# Altium schematic sheet TK106_MIDI.SchDoc
size A3; Revision: 6
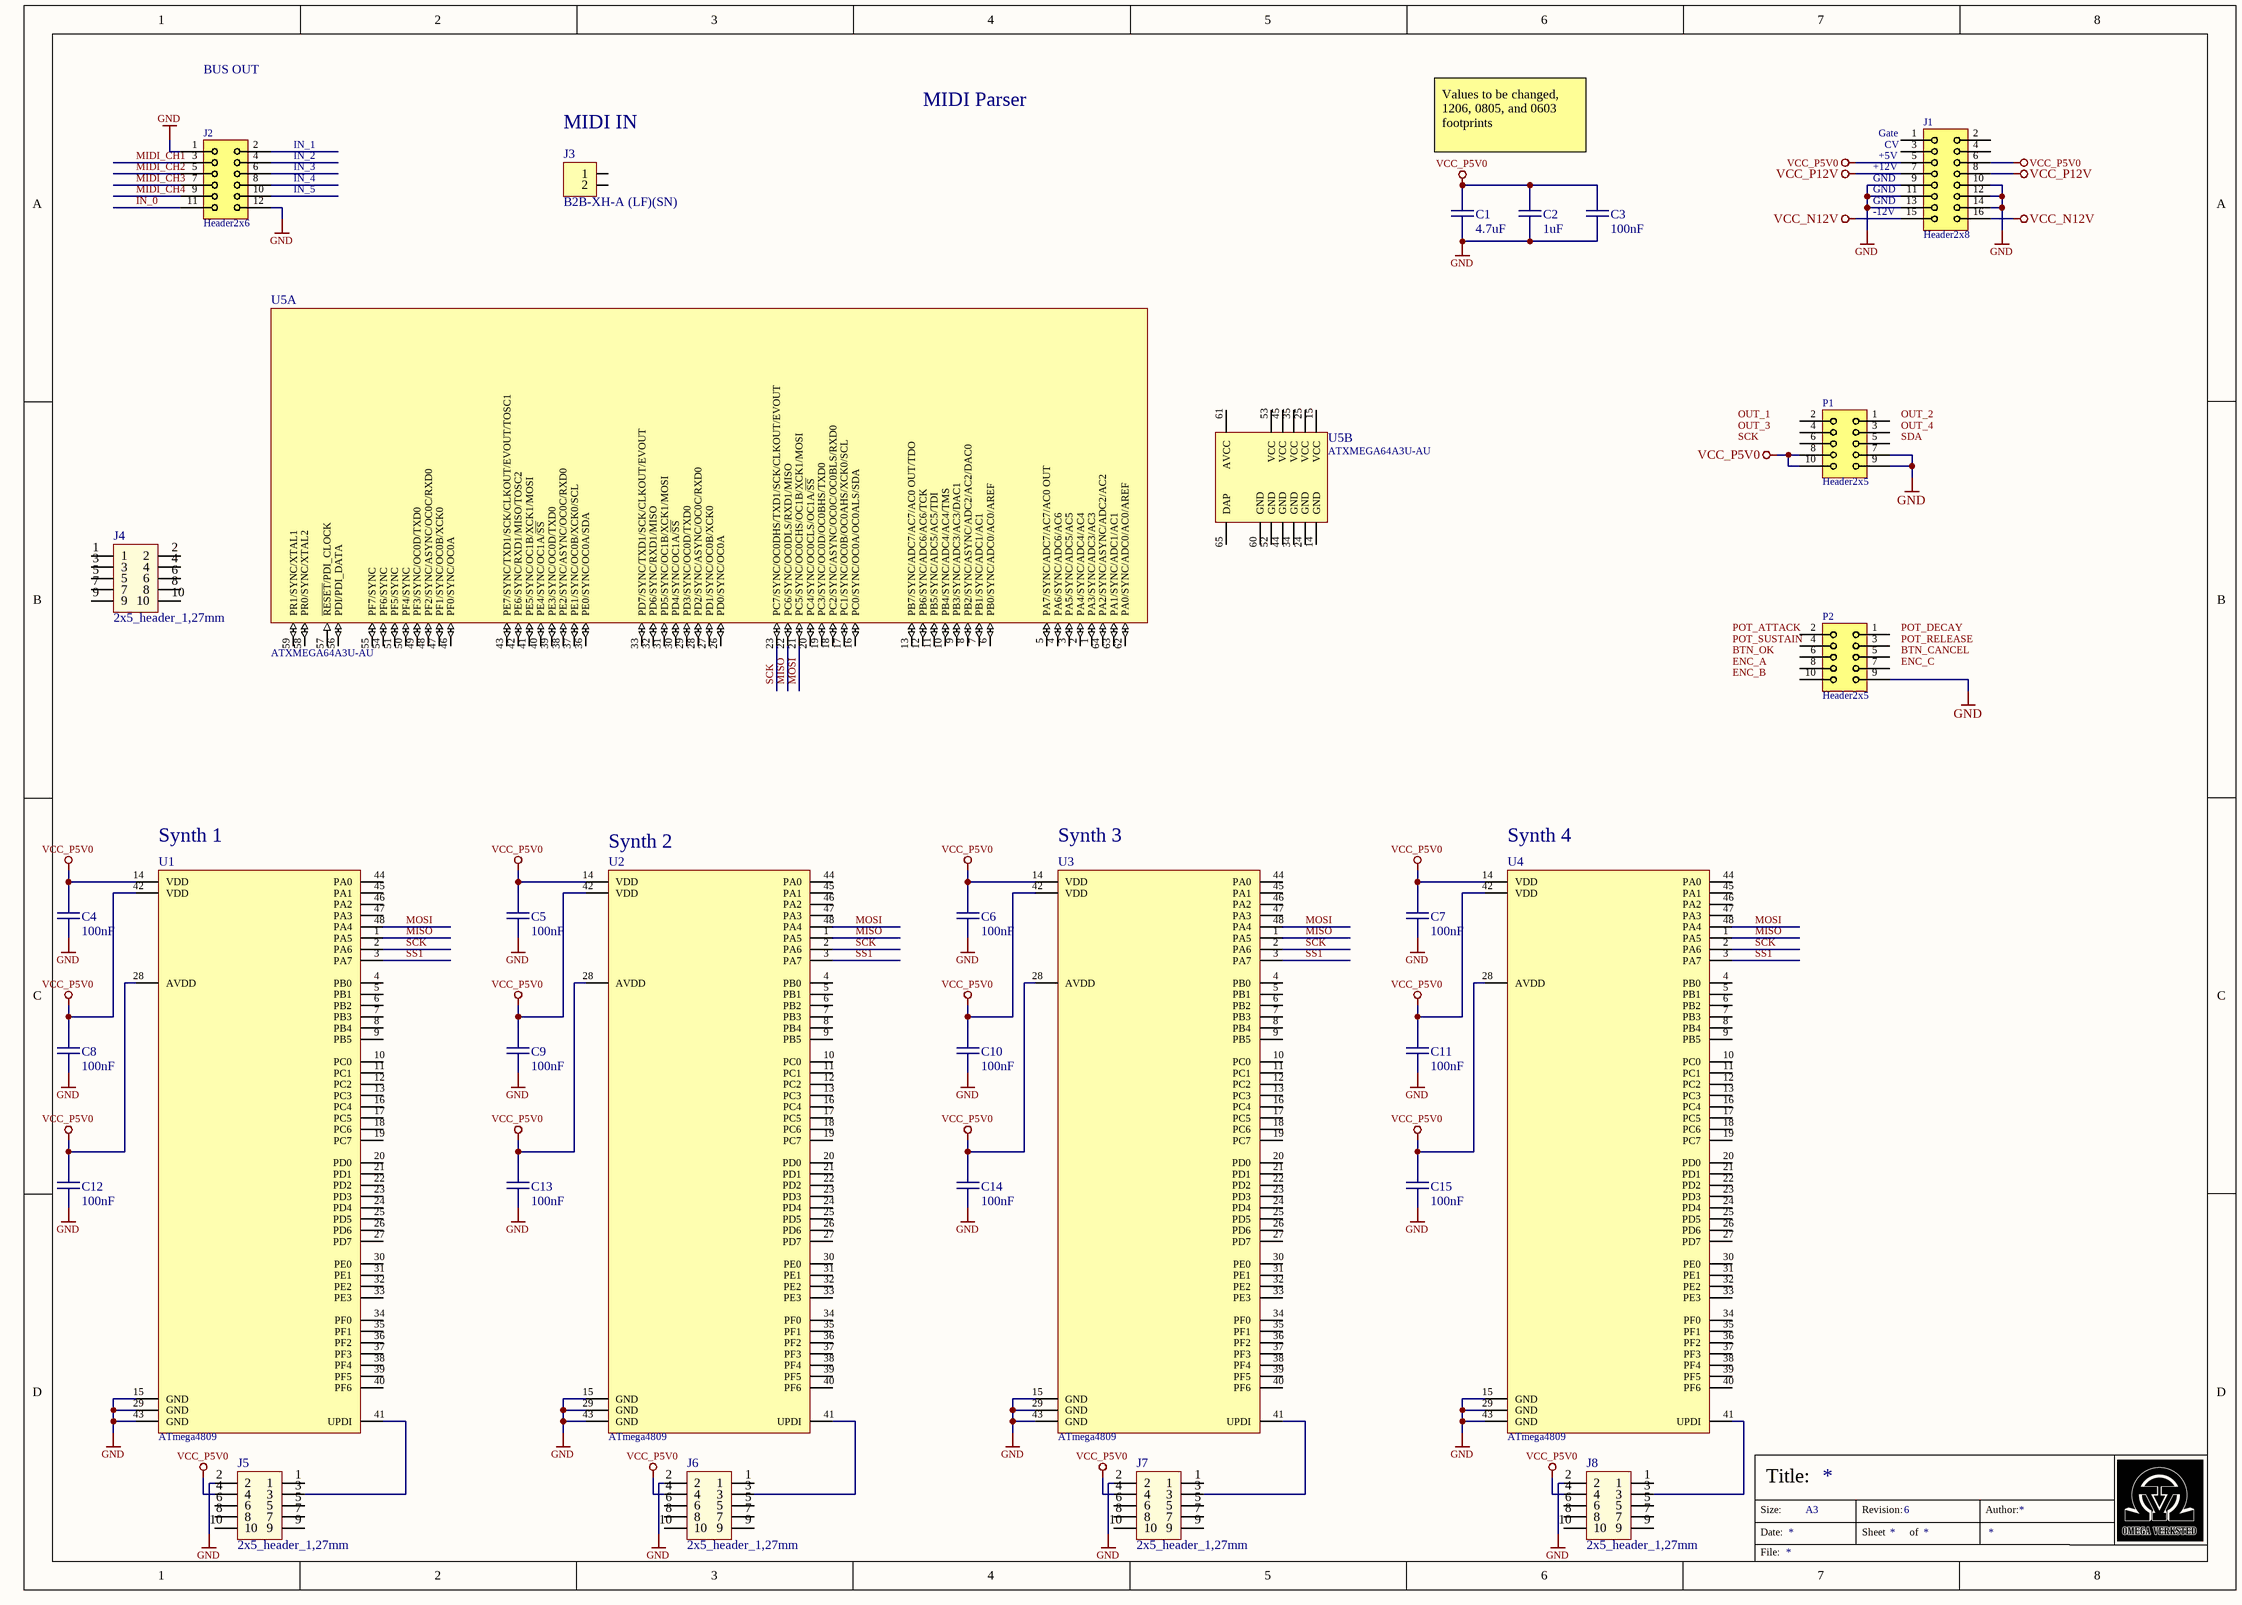
[diagram p0: TK106_MIDI.SchDoc]

## Parts
C1  4.7uF  [CAPC1206(3216)170_N]
C2  1uF  [CAPC0805(2012)100_N]
C3  100nF  [CAPC0603(1608)55_N]
C4  100nF  [CAPC0603(1608)55_N]
C5  100nF  [CAPC0603(1608)55_N]
C6  100nF  [CAPC0603(1608)55_N]
C7  100nF  [CAPC0603(1608)55_N]
C8  100nF  [CAPC0603(1608)55_N]
C9  100nF  [CAPC0603(1608)55_N]
C10  100nF  [CAPC0603(1608)55_N]
C11  100nF  [CAPC0603(1608)55_N]
C12  100nF  [CAPC0603(1608)55_N]
C13  100nF  [CAPC0603(1608)55_N]
C14  100nF  [CAPC0603(1608)55_N]
C15  100nF  [CAPC0603(1608)55_N]
J1  Header2x8  [HDRV16W64P254_2X8_Shrouded]
J2  Header2x6  [HDRV12W64P254_2X6_Shrouded]
J3  B2B-XH-A (LF)(SN)  [JST_2P]
J4  2x5_header_1,27mm  [SMDHDRV10P127_2X5_615X330X560B]
J5  2x5_header_1,27mm  [SMDHDRV10P127_2X5_615X330X560B]
J6  2x5_header_1,27mm  [SMDHDRV10P127_2X5_615X330X560B]
J7  2x5_header_1,27mm  [SMDHDRV10P127_2X5_615X330X560B]
J8  2x5_header_1,27mm  [SMDHDRV10P127_2X5_615X330X560B]
P1  Header2x5  [HDRV10W64P254_2X5_Female]
P2  Header2x5  [HDRV10W64P254_2X5_Female]
U1  ATmega4809  [TQFP50P900X900X120-48N]
U2  ATmega4809  [TQFP50P900X900X120-48N]
U3  ATmega4809  [TQFP50P900X900X120-48N]
U4  ATmega4809  [TQFP50P900X900X120-48N]
U5  ATXMEGA64A3U-AU  [TQFP64]  (parts A,B of 2)

## Nets
GND: C1.1 C2.1 C3.1 C4.1 C5.1 C6.1 C7.1 C8.1 C9.1 C10.1 C11.1 C12.1 C13.1 C14.1 C15.1 J1.9 J1.10 J1.11 J1.12 J1.13 J1.14 J2.1 J2.12 J5.2 J6.2 J7.2 J8.2 P1.7 P1.9 P2.9 U1.15(GND) U1.29(GND) U1.43(GND) U2.15(GND) U2.29(GND) U2.43(GND) U3.15(GND) U3.29(GND) U3.43(GND) U4.15(GND) U4.29(GND) U4.43(GND)
VCC_N12V: J1.15 J1.16
VCC_P5V0: C1.2 C2.2 C3.2 C4.2 C5.2 C6.2 C7.2 C8.2 C9.2 C10.2 C11.2 C12.2 C13.2 C14.2 C15.2 J1.5 J1.6 J5.4 J6.4 J7.4 J8.4 P1.8 P1.10 U1.14(VDD) U1.28(AVDD) U1.42(VDD) U2.14(VDD) U2.28(AVDD) U2.42(VDD) U3.14(VDD) U3.28(AVDD) U3.42(VDD) U4.14(VDD) U4.28(AVDD) U4.42(VDD)
VCC_P12V: J1.7 J1.8
IN_0: J2.11
MIDI_CH1: J2.3
MIDI_CH2: J2.5
MIDI_CH3: J2.7
MIDI_CH4: J2.9
MISO: U1.1(PA5) U2.1(PA5) U3.1(PA5) U4.1(PA5) U5.22(PC6/SYNC/OC0DLS/RXD1/MISO)
MOSI: U1.48(PA4) U2.48(PA4) U3.48(PA4) U4.48(PA4) U5.21(PC5/SYNC/OC0CHS/OC1B/XCK1/MOSI)
SCK: U1.2(PA6) U2.2(PA6) U3.2(PA6) U4.2(PA6) U5.23(PC7/SYNC/OC0DHS/TXD1/SCK/CLKOUT/EVOUT)
SS1: U1.3(PA7) U2.3(PA7) U3.3(PA7) U4.3(PA7)
NetJ5_3: J5.3 U1.41(UPDI)
NetJ6_3: J6.3 U2.41(UPDI)
NetJ7_3: J7.3 U3.41(UPDI)
NetJ8_3: J8.3 U4.41(UPDI)

Not connected (* = marked no-connect by the designer): J1 1 2 3 4; J2 2 4 6 8 10; J3 1 2; J4 1 2 3 4 5 6 7 8 9 10; J5 1 5 6 7 8 9 10; J6 1 5 6 7 8 9 10; J7 1 5 6 7 8 9 10; J8 1 5 6 7 8 9 10; P1 1 2 3 4 5 6; P2 1 2 3 4 5 6 7 8 10; U1 4(PB0) 5(PB1) 6(PB2) 7(PB3) 8(PB4) 9(PB5) 10(PC0) 11(PC1) 12(PC2) 13(PC3) 16(PC4) 17(PC5) 18(PC6) 19(PC7) 20(PD0) 21(PD1) 22(PD2) 23(PD3) 24(PD4) 25(PD5) 26(PD6) 27(PD7) 30(PE0) 31(PE1) 32(PE2) 33(PE3) 34(PF0) 35(PF1) 36(PF2) 37(PF3) 38(PF4) 39(PF5) 40(PF6) 44(PA0) 45(PA1) 46(PA2) 47(PA3); U2 4(PB0) 5(PB1) 6(PB2) 7(PB3) 8(PB4) 9(PB5) 10(PC0) 11(PC1) 12(PC2) 13(PC3) 16(PC4) 17(PC5) 18(PC6) 19(PC7) 20(PD0) 21(PD1) 22(PD2) 23(PD3) 24(PD4) 25(PD5) 26(PD6) 27(PD7) 30(PE0) 31(PE1) 32(PE2) 33(PE3) 34(PF0) 35(PF1) 36(PF2) 37(PF3) 38(PF4) 39(PF5) 40(PF6) 44(PA0) 45(PA1) 46(PA2) 47(PA3); U3 4(PB0) 5(PB1) 6(PB2) 7(PB3) 8(PB4) 9(PB5) 10(PC0) 11(PC1) 12(PC2) 13(PC3) 16(PC4) 17(PC5) 18(PC6) 19(PC7) 20(PD0) 21(PD1) 22(PD2) 23(PD3) 24(PD4) 25(PD5) 26(PD6) 27(PD7) 30(PE0) 31(PE1) 32(PE2) 33(PE3) 34(PF0) 35(PF1) 36(PF2) 37(PF3) 38(PF4) 39(PF5) 40(PF6) 44(PA0) 45(PA1) 46(PA2) 47(PA3); U4 4(PB0) 5(PB1) 6(PB2) 7(PB3) 8(PB4) 9(PB5) 10(PC0) 11(PC1) 12(PC2) 13(PC3) 16(PC4) 17(PC5) 18(PC6) 19(PC7) 20(PD0) 21(PD1) 22(PD2) 23(PD3) 24(PD4) 25(PD5) 26(PD6) 27(PD7) 30(PE0) 31(PE1) 32(PE2) 33(PE3) 34(PF0) 35(PF1) 36(PF2) 37(PF3) 38(PF4) 39(PF5) 40(PF6) 44(PA0) 45(PA1) 46(PA2) 47(PA3); U5 1(PA3/SYNC/ADC3/AC3) 2(PA4/SYNC/ADC4/AC4) 3(PA5/SYNC/ADC5/AC5) 4(PA6/SYNC/ADC6/AC6) 5(PA7/SYNC/ADC7/AC7/AC0_OUT) 6(PB0/SYNC/ADC0/AC0/AREF) 7(PB1/SYNC/ADC1/AC1) 8(PB2/SYNC/ASYNC/ADC2/AC2/DAC0) 9(PB3/SYNC/ADC3/AC3/DAC1) 10(PB4/SYNC/ADC4/AC4/TMS) 11(PB5/SYNC/ADC5/AC5/TDI) 12(PB6/SYNC/ADC6/AC6/TCK) 13(PB7/SYNC/ADC7/AC7/AC0_OUT/TDO) 14(GND) 15(VCC) 16(PC0/SYNC/OC0A/OC0ALS/SDA) 17(PC1/SYNC/OC0B/OC0AHS/XCK0/SCL) 18(PC2/SYNC/ASYNC/OC0C/OC0BLS/RXD0) 19(PC3/SYNC/OC0D/OC0BHS/TXD0) 20(PC4/SYNC/OC0CLS/OC1A/~{SS}) 24(GND) 25(VCC) 26(PD0/SYNC/OC0A) 27(PD1/SYNC/OC0B/XCK0) 28(PD2/SYNC/ASYNC/OC0C/RXD0) 29(PD3/SYNC/OC0D/TXD0) 30(PD4/SYNC/OC1A/~{SS}) 31(PD5/SYNC/OC1B/XCK1/MOSI) 32(PD6/SYNC/RXD1/MISO) 33(PD7/SYNC/TXD1/SCK/CLKOUT/EVOUT) 34(GND) 35(VCC) 36(PE0/SYNC/OC0A/SDA) 37(PE1/SYNC/OC0B/XCK0/SCL) 38(PE2/SYNC/ASYNC/OC0C/RXD0) 39(PE3/SYNC/OC0D/TXD0) 40(PE4/SYNC/OC1A/~{SS}) 41(PE5/SYNC/OC1B/XCK1/MOSI) 42(PE6/SYNC/RXD1/MISO/TOSC2) 43(PE7/SYNC/TXD1/SCK/CLKOUT/EVOUT/TOSC1) 44(GND) 45(VCC) 46(PF0/SYNC/OC0A) 47(PF1/SYNC/OC0B/XCK0) 48(PF2/SYNC/ASYNC/OC0C/RXD0) 49(PF3/SYNC/OC0D/TXD0) 50(PF4/SYNC) 51(PF5/SYNC) 52(GND) 53(VCC) 54(PF6/SYNC) 55(PF7/SYNC) 56(PDI/PDI_DATA) 57(~{RESET}/PDI_CLOCK) 58(PR0/SYNC/XTAL2) 59(PR1/SYNC/XTAL1) 60(GND) 61(AVCC) 62(PA0/SYNC/ADC0/AC0/AREF) 63(PA1/SYNC/ADC1/AC1) 64(PA2/SYNC/ASYNC/ADC2/AC2) 65(DAP)

## Notes on the sheet
- BUS OUT
- MIDI Parser
- (near J2) IN_1
- (near J2) IN_2
- (near J2) IN_3
- (near J2) IN_4
- (near J2) IN_5
- (near J3) MIDI IN
- Values to be changed, 1206, 0805, and 0603 footprints
- (near J1) GND
- (near J1) +12V
- (near J1) +5V
- (near J1) Gate
- (near J1) CV
- (near J1) -12V
- (near U1) Synth 1
- (near U2) Synth 2
- (near U3) Synth 3
- (near U4) Synth 4
- Labels drawn without touching a wire or pin: BTN_CANCEL, BTN_OK, ENC_A, ENC_B, ENC_C, OUT_1, OUT_2, OUT_3, OUT_4, POT_ATTACK, POT_DECAY, POT_RELEASE, POT_SUSTAIN, SCK, SDA
- Size:
- Date:
- Title:
- A3
- Revision:
- Sheet
- of
- Author:
- File:

## Library data of the parts
C1 = 2992: X7R 50V; id: 2992; pakke_opprettet_av: 815; pakke_opprettet: 11.02.2015 13.21.22; symbol_opprettet: 14.11.2014 20.19.34; pris: 1; nokkelord: Kondensator, capacitor; produsent: Multikomp; pakketype: 1206; symbol_opprettet_av: 815; navn: 4.7uF
C2 = 3582: X7R 50V 10%; id: 3582; pakke_opprettet_av: 815; pakke_opprettet: 14.11.2014 20.52.01; symbol_opprettet: 14.11.2014 20.19.34; leverandor_varenr: 1735541; pris: 4; nokkelord: Kondensator, capacitor; produsent: Murata; leverandor: Farnell; pakketype: 0805; symbol_opprettet_av: 815; navn: 1uF
C3 = 3028: X7R 50V 5%; id: 3028; pakke_opprettet_av: 815; pakke_opprettet: 18.02.2015 14.18.13; symbol_opprettet: 14.11.2014 20.19.34; leverandor_varenr: 1759122; pris: 1; nokkelord: Kondensator, Capacitor, CAP; produsent: Multikomp; leverandor: Farnell; pakketype: 0603; symbol_opprettet_av: 815; navn: 100nF
C4-C15 = 3028: X7R 50V 5%; id: 3028; pakke_opprettet_av: 815; leverandor_varenr: 1759122; pris: 1; nokkelord: Kondensator, Capacitor, CAP; produsent: Multikomp; leverandor: Farnell; pakketype: 0603; pakke_opprettet: 2/18/2015 2:18:13 PM; symbol_opprettet_av: 815; symbol_opprettet: 11/14/2014 8:19:34 PM; navn: 100nF
J1 = 4645: id: 4645; pakke_opprettet_av: 815; beskrivelse: Header; navn: Header Shrouded 2X8P; pris: 10; pakketype: TH; pakke_opprettet: 2019-02-14 23:39:48; symbol_opprettet_av: 815; symbol_opprettet: 2014-11-13 11:08:32; nokkelord: Header
J2 = 4622: id: 4622; pakke_opprettet_av: 815; beskrivelse: Header Shrouded; navn: Header 2X6 Shrouded; pris: 16; nokkelord: Header; pakketype: TH; komponenttype: 11; pakke_opprettet: 16/02/2019 14:00:24; symbol_opprettet_av: 815; symbol_opprettet: 13/11/2014 11:04:02
J3 = 2227: id: 2227; rad: 1; rom: GM; lager_type: Baklager; dybde: 2; hylle: 0; antall: 206; pakke_opprettet_av: 815; beskrivelse: JST 2pin (pris pr. stk.); leverandor_varenr: 1516276; nokkelord: Connector, Kontakt; produsent: JST; leverandor: Farnell; pakketype: TH; kolonne: 0; pakke_opprettet: 28.06.2014 18:25:03; symbol_opprettet_av: 815; symbol_opprettet: 28.06.2014 15:33:17; navn: B2B-XH-A (LF)(SN); pris: 2
J4-J8 = 2449: id: 2449; rad: 4; rom: OV; lager_type: Fremlager; dybde: 0; hylle: 6; antall: 55; pakke_opprettet_av: 815; symbol_opprettet_av: 1366; beskrivelse: 1,27mm Pitch SMD Header; navn: Header SMD 127 2x5; pris: 20; nokkelord: JTAG; pakketype: SMD; kolonne: 0; pakke_opprettet: 15.11.2014 18:30:38; symbol_opprettet: 11.03.2019 22:06:02
P1 P2 = 5661: id: 5661; pakke_opprettet_av: 815; beskrivelse: Header; navn: Header 2X5 Female; pris: 5; pakketype: TH; komponenttype: 11; pakke_opprettet: 31/01/2020 22:57:35; symbol_opprettet_av: 815; symbol_opprettet: 13/11/2014 11:03:55; nokkelord: Header
U1-U4 = 4733: id: 4733; pakke_opprettet_av: 815; beskrivelse: 8-bit mikrokontroller; pris: 0; nokkelord: AVR, atmel, microchip; produsent: Atmel; pakketype: TQFP; pakke_opprettet: 24.06.2019 20:42:06; symbol_opprettet_av: 815; symbol_opprettet: 24.06.2019 21:16:45; navn: ATmega4809
U5 = 2105: id: 2105; rad: 44; rom: GM; lager_type: Baklager; dybde: 1; hylle: 0; antall: 900; pakke_opprettet_av: 815; beskrivelse: Mikrokontroller; produsent: Atmel; pakketype: TQFP; kolonne: 0; pakke_opprettet: 13.07.2014 19:45:53; symbol_opprettet_av: 815; symbol_opprettet: 07.05.2015 23:14:48; navn: ATXMEGA64A3U-AU; pris: 0